# EasyEDA Pro project PCB.eprj, schematic Control_Logic
Board Name: Control_Logic; Create Date: 2025-08-13; Page Name: P1; Project Name: PCB; Schematic Name: Control_Logic; Update Date: 2025-08-13; Company: EasyEDA.com; Page Size: A4; Version: V1.0
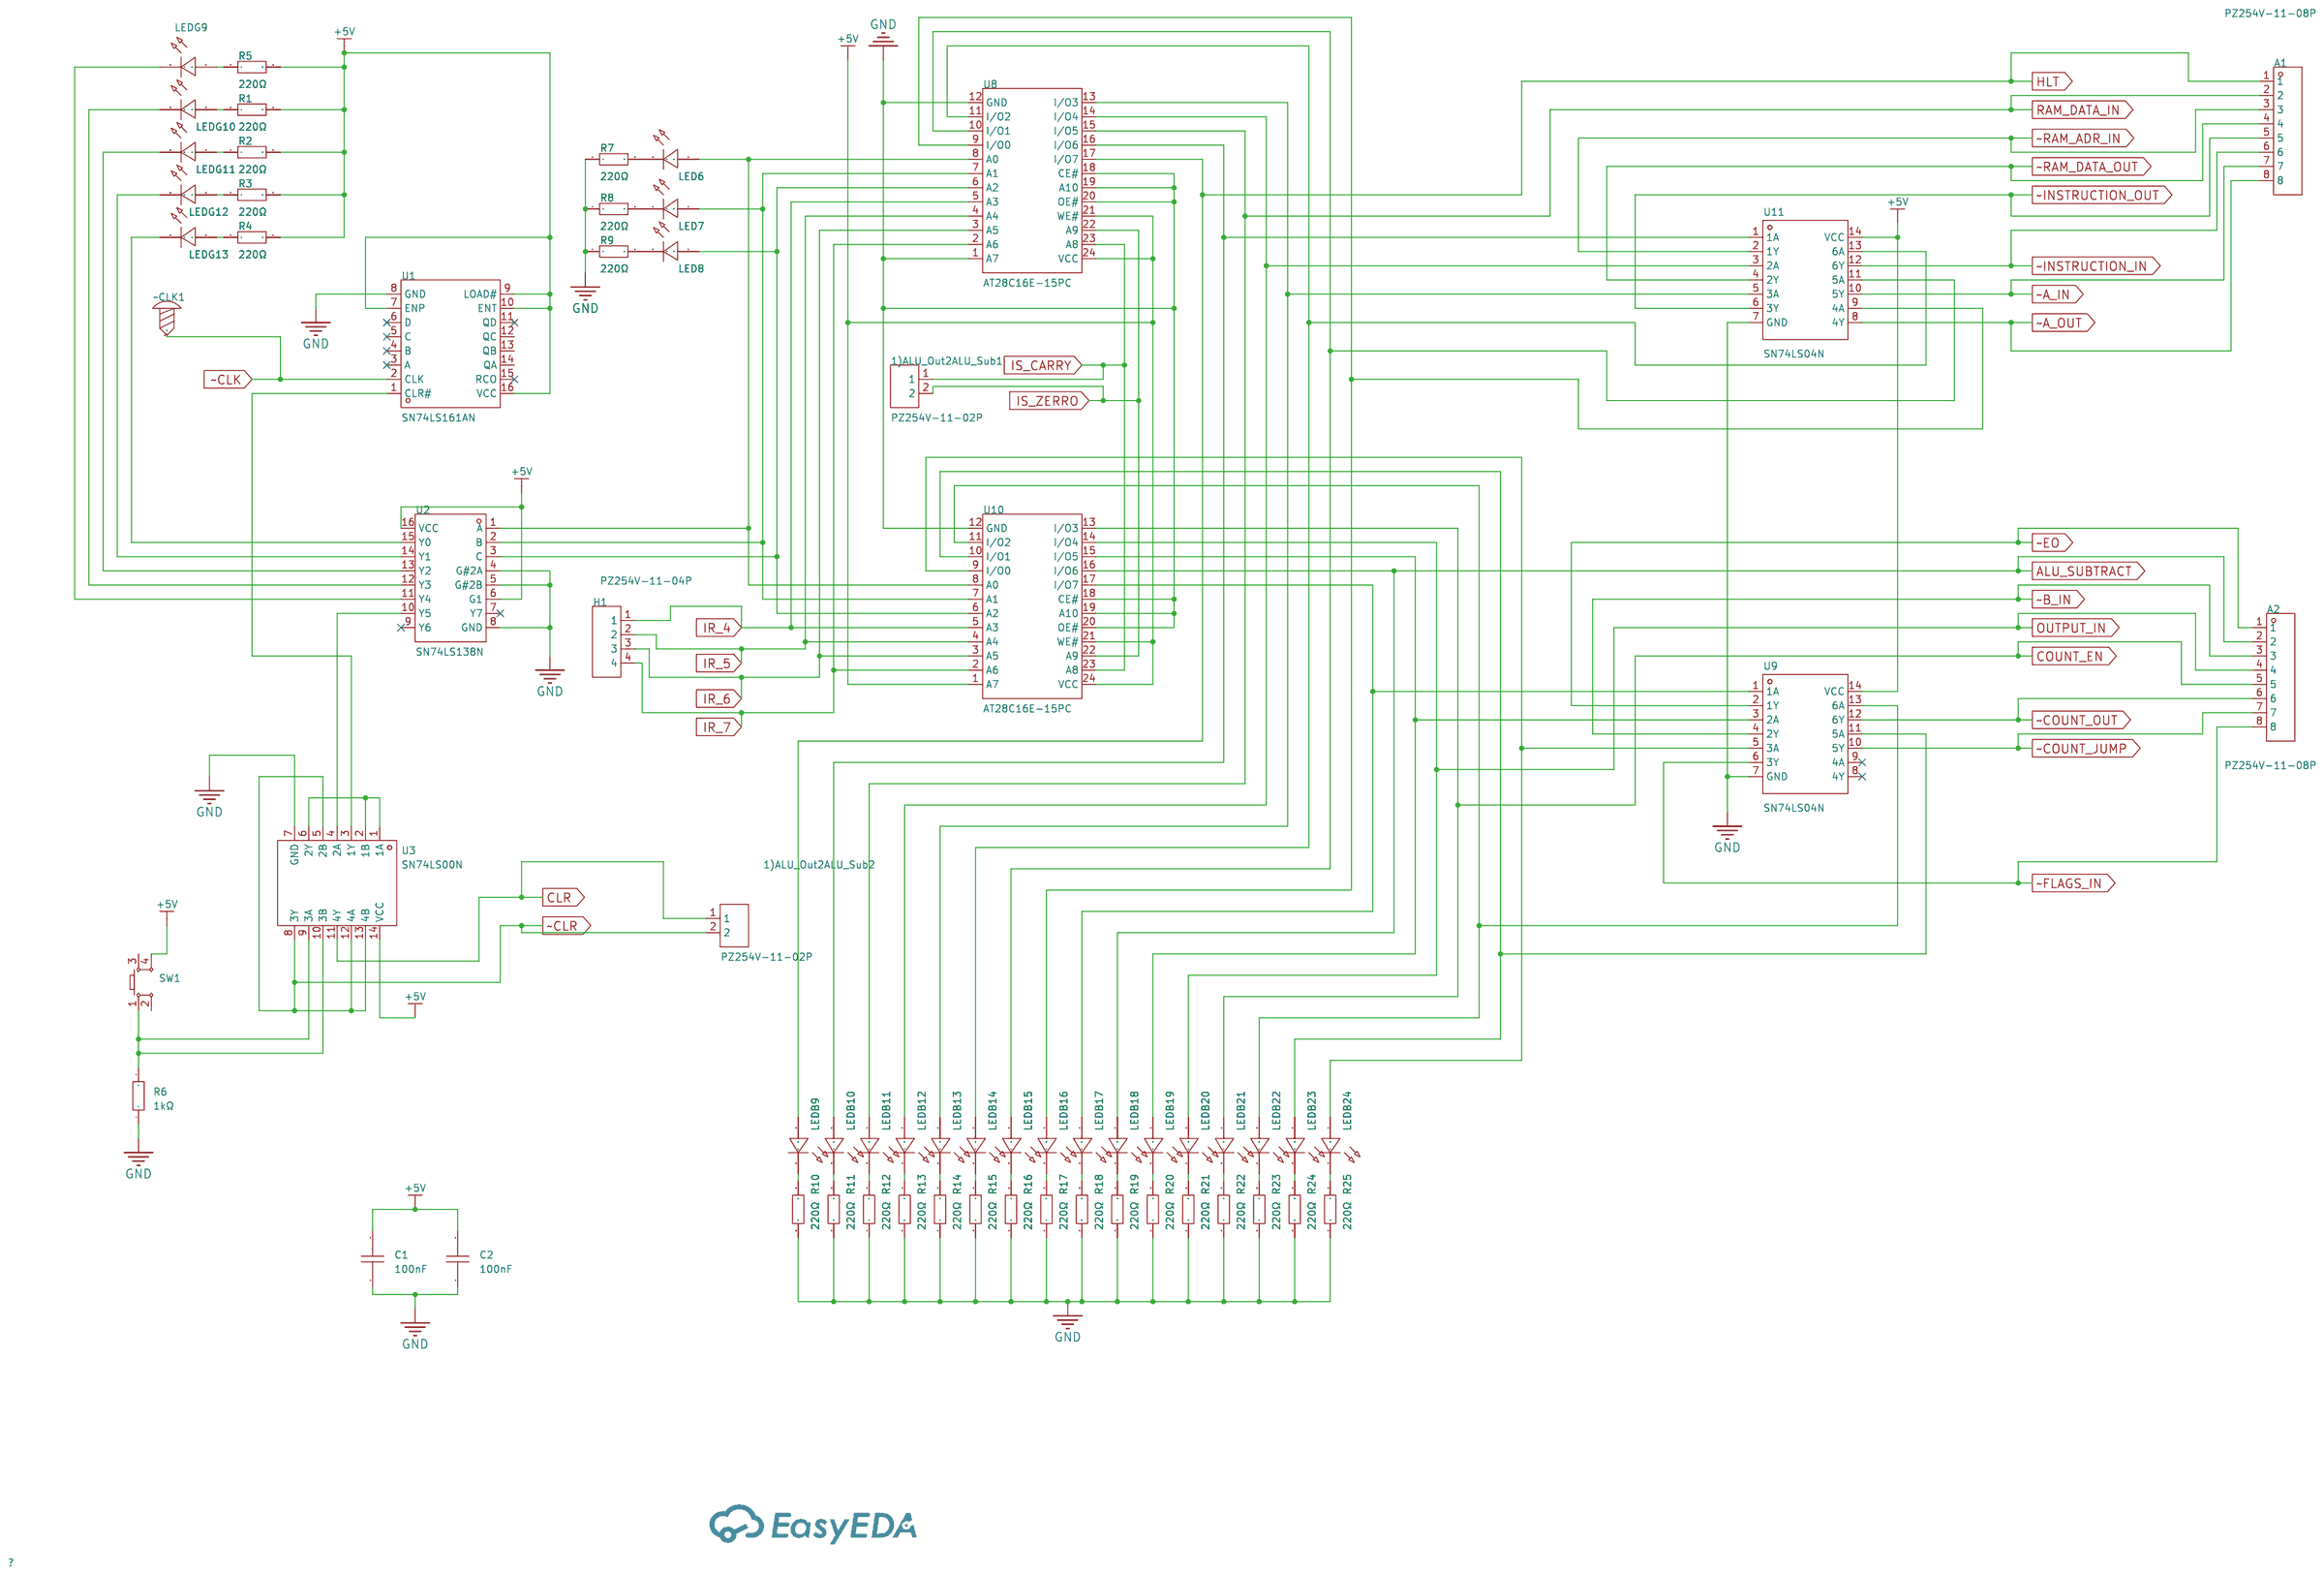
[diagram p7: schematic sheet]

## Parts
1)ALU_Out2ALU_Sub1  PZ254V-11-02P  [HDR-TH_2P-P2.54-V-M]
1)ALU_Out2ALU_Sub2  PZ254V-11-02P  [HDR-TH_2P-P2.54-V-M]
A1  PZ254V-11-08P  [HDR-TH_8P-P2.54-V-M]
A2  PZ254V-11-08P  [HDR-TH_8P-P2.54-V-M]
C1  100nF  [CAP-TH_L8.5-W5.0-P5.00-D1.2]
C2  100nF  [CAP-TH_L8.5-W5.0-P5.00-D1.2]
H1  PZ254V-11-04P  [HDR-TH_4P-P2.54-V-M]
LED6  -  [LED-TH_BD5.8-P2.54-FD]
LED7  -  [LED-TH_BD5.8-P2.54-FD]
LED8  -  [LED-TH_BD5.8-P2.54-FD]
LEDB9  -  [LED-TH_BD5.8-P2.54-FD]
LEDB10  -  [LED-TH_BD5.8-P2.54-FD]
LEDB11  -  [LED-TH_BD5.8-P2.54-FD]
LEDB12  -  [LED-TH_BD5.8-P2.54-FD]
LEDB13  -  [LED-TH_BD5.8-P2.54-FD]
LEDB14  -  [LED-TH_BD5.8-P2.54-FD]
LEDB15  -  [LED-TH_BD5.8-P2.54-FD]
LEDB16  -  [LED-TH_BD5.8-P2.54-FD]
LEDB17  -  [LED-TH_BD5.8-P2.54-FD]
LEDB18  -  [LED-TH_BD5.8-P2.54-FD]
LEDB19  -  [LED-TH_BD5.8-P2.54-FD]
LEDB20  -  [LED-TH_BD5.8-P2.54-FD]
LEDB21  -  [LED-TH_BD5.8-P2.54-FD]
LEDB22  -  [LED-TH_BD5.8-P2.54-FD]
LEDB23  -  [LED-TH_BD5.8-P2.54-FD]
LEDB24  -  [LED-TH_BD5.8-P2.54-FD]
LEDG9  -  [LED-TH_BD5.8-P2.54-FD]
LEDG10  -  [LED-TH_BD5.8-P2.54-FD]
LEDG11  -  [LED-TH_BD5.8-P2.54-FD]
LEDG12  -  [LED-TH_BD5.8-P2.54-FD]
LEDG13  -  [LED-TH_BD5.8-P2.54-FD]
R1  220Ω  [R_AXIAL-0.4]
R2  220Ω  [R_AXIAL-0.4]
R3  220Ω  [R_AXIAL-0.4]
R4  220Ω  [R_AXIAL-0.4]
R5  220Ω  [R_AXIAL-0.4]
R6  1kΩ  [R_AXIAL-0.4]
R7  220Ω  [R_AXIAL-0.4]
R8  220Ω  [R_AXIAL-0.4]
R9  220Ω  [R_AXIAL-0.4]
R10  220Ω  [R_AXIAL-0.4]
R11  220Ω  [R_AXIAL-0.4]
R12  220Ω  [R_AXIAL-0.4]
R13  220Ω  [R_AXIAL-0.4]
R14  220Ω  [R_AXIAL-0.4]
R15  220Ω  [R_AXIAL-0.4]
R16  220Ω  [R_AXIAL-0.4]
R17  220Ω  [R_AXIAL-0.4]
R18  220Ω  [R_AXIAL-0.4]
R19  220Ω  [R_AXIAL-0.4]
R20  220Ω  [R_AXIAL-0.4]
R21  220Ω  [R_AXIAL-0.4]
R22  220Ω  [R_AXIAL-0.4]
R23  220Ω  [R_AXIAL-0.4]
R24  220Ω  [R_AXIAL-0.4]
R25  220Ω  [R_AXIAL-0.4]
SW1  -  [KEY-TH_4P-L6.0-W6.0-P3.90-LS6.5]
U1  SN74LS161AN  [PDIP-16_L19.3-W6.4-P2.54-LS7.9-BL]
U2  SN74LS138N  [DIP-16_L19.8-W6.5-P2.54-LS7.6-BL]
U3  SN74LS00N  [PDIP-14_L19.7-W6.6-P2.54-LS8.3-BL]
U8  AT28C16E-15PC  [PDIP-24_L31.0-W13.5-P2.54-LS15.2-BL]
U9  SN74LS04N  [PDIP-14_L19.7-W6.6-P2.54-LS8.3-BL]
U10  AT28C16E-15PC  [PDIP-24_L31.0-W13.5-P2.54-LS15.2-BL]
U11  SN74LS04N  [PDIP-14_L19.7-W6.6-P2.54-LS8.3-BL]
~CLK1  -  [Screw-Hole-M2]

## Library data of the parts
1)ALU_Out2ALU_Sub1 1)ALU_Out2ALU_Sub2 = PZ254V-11-02P: LCSC Part Name: 1x2P 间距:2.54mm 方针 直插; Supplier Part: C492401; Manufacturer: XFCN(兴飞); Supplier Footprint: 插件,P=2.54mm; JLCPCB Part Class: Extended Part; Datasheet: https://atta.szlcsc.com/upload/public/pdf/source/20200309/C492401_A812433581A9B211A7FFA413ADDFF0E5.pdf; Supplier: LCSC; Pin Structure: 1x2P; Pitch: 2.54mm; Circluar Pins/Square Pins: Policy; Mounting Type: Straight; Number of Rows: Single Row; Number of Pins: 2P; Length of Mating Pin: 6mm; Insulation Height: 2.5mm; Length of End Connection Pin: 3mm; Contact Material: Brass; Operating Temperature: -40℃~+105℃; Color: Black
A1 A2 = PZ254V-11-08P: LCSC Part Name: 间距:2.54mm 1x8P 直插 方针; Supplier Part: C492407; Manufacturer: XFCN(兴飞); Supplier Footprint: 插件,P=2.54mm; JLCPCB Part Class: Extended Part; Datasheet: https://atta.szlcsc.com/upload/public/pdf/source/20200309/C492407_83A6FB26A2233368EDB9516968EC6149.pdf; Supplier: LCSC; Pin Structure: 1x8P; Pitch: 2.54mm; Circluar Pins/Square Pins: Square Pins; Mounting Type: Straight; Number of Rows: Plugin; Number of Pins: 8P; Length of Mating Pin: 6mm; Insulation Height: 2.5mm; Length of End Connection Pin: 3mm; Operating Temperature Range: -40℃~+105℃; Color: Black
C1 C2 = CT4-0805B104K500F3: LCSC Part Name: 100nF ±10% 50V C3型（直脚）; Supplier Part: C84772; Manufacturer: FH(风华); Supplier Footprint: 插件,P=5.08mm; JLCPCB Part Class: Extended Part; Datasheet: https://atta.szlcsc.com/upload/public/pdf/source/20190402/C385200_059806A6312B28FF1421A2413EB641E1.pdf; Supplier: LCSC; Tolerance: ±10%
H1 = PZ254V-11-04P_C492403: LCSC Part Name: 1x4P 间距:2.54mm 方针 直插; Supplier Part: C492403; Manufacturer: XFCN(兴飞); Supplier Footprint: 插件,P=2.54mm; JLCPCB Part Class: Extended Part; Datasheet: https://atta.szlcsc.com/upload/public/pdf/source/20200309/C492403_F9F19131791D08044AD4F84F8E751A34.pdf; Supplier: LCSC; Pin Structure: 1x4P; Pitch: 2.54mm; Circluar Pins/Square Pins: Policy; Mounting Type: Straight; Number of Rows: Single Row; Number of Pins: 4P; Length of Mating Pin: 6mm; Insulation Height: 2.5mm; Length of End Connection Pin: 3mm; Contact Material: Brass; Operating Temperature: -40℃~+105℃; Color: Black
LED6-LED8 LEDB9-LEDB24 LEDG9-LEDG13 = LED_TH-R_5mm: Supplier Footprint: Through
R1-R25 = Res_AXIAL-1/4W: Supplier Footprint: Through
SW1 = Key_TH_6x6x4.5: Supplier Footprint: Through
U1 = SN74LS161AN: LCSC Part Name: 25MHz 4位二进制计数器; Supplier Part: C1547960; Manufacturer: TI(德州仪器); Supplier Footprint: PDIP-16; JLCPCB Part Class: Extended Part; Datasheet: https://www.ti.com/cn/lit/gpn/sn74ls161a; Supplier: LCSC; Logic Type: Binary Counter; Direction: 向上计数器; Supply Voltage: 4.75V~5.25V; Number of Elements: 1; Number of Bits per Element: 4; Trigger Type: Positive Edge; Reset Style: 异步; Timing mode: Synchronous; Count Rate: 25MHz; Operating Temperature: 0℃~+70℃
U2 = SN74LS138N: Type:Decoder/Demultiplexers Voltage Supply Source:Single supply Supply Voltage:4.75V~5.25V Supply Voltage:4.75V~5.25V Sink Current:8mA Source Current:400uA Operating temperature:0℃~+70℃ Operating temperature:0℃~+70℃; Supplier Part: C352964; Manufacturer: TI(德州仪器); Supplier Footprint: DIP-16; JLCPCB Part Class: Extended Part; Datasheet: https://www.ti.com/cn/lit/gpn/sn74ls138; Supplier: LCSC; Type: Decoder/Demultiplexers; Voltage Supply Source: Single supply; Supply Voltage: 4.75V~5.25V; Sink Current: 8mA; Source Current: 400uA; Operating temperature: 0℃~+70℃
U3 = SN74LS00N: Logic Type:NAND Gate Number of Channels:4 Voltage - Supply:4.75V~5.25V Voltage - Supply:4.75V~5.25V Current - Output Low(IOL):8mA Current - Output High(IOH):400uA Input Logic Level - High:2V Input Logic Level - High:2V Input Logic Level - Low:800mV Input; Supplier Part: C181629; Manufacturer: TI(德州仪器); Supplier Footprint: PDIP-14; JLCPCB Part Class: Extended Part; Datasheet: https://www.ti.com/cn/lit/gpn/sn74ls00; Supplier: LCSC; Logic Type: NAND Gate; Number of Channels: 4; Voltage - Supply: 4.75V~5.25V; Current - Output Low(IOL): 8mA; Current - Output High(IOH): 400uA; Input Logic Level - High: 2V; Input Logic Level - Low: 800mV; Series: 74LSSeries; Propagation Delay: 15ns@5V,15pF; Operating Temperature: 0℃~+70℃
U8 U10 = AT28C16E-15PC: Supplier Part: C19393057; Manufacturer: MICROCHIP(美国微芯); Supplier Footprint: PDIP-24; JLCPCB Part Class: Extended Part; Datasheet: https://atta.szlcsc.com/upload/public/pdf/source/20231219/98B154FA288F53C07025EE50A49045E4.pdf; Supplier: LCSC
U9 U11 = SN74LS04N: Supplier Part: C183657; Manufacturer: TI(德州仪器); Supplier Footprint: PDIP-14; JLCPCB Part Class: Extended Part; Datasheet: https://www.ti.com/cn/lit/gpn/sn74ls04; Supplier: LCSC; Voltage - Supply: 4.75V~5.25V; Number of Circuits: 6; Number of Inputs: 1; Current - Output Low(IOL): 8mA; Current - Output High(IOH): 400uA; Input Logic Level - High: 2V; Input Logic Level -Low: 800mV; Max Propagation Delay: 15ns@5V,15pF; Series: 74LSSeries; Operating Temperature: 0℃~+70℃
~CLK1 = Screw-Hole-M2: Supplier Footprint: 插件

## Nets
+5V: C1.2 C2.2 R1.2 R2.2 R3.2 R4.2 R5.2 SW1.4 U1.7(ENP) U1.9(LOAD#) U1.10(ENT) U1.16(VCC) U2.6(G1) U2.16(VCC) U3.14(VCC) U8.21(WE#) U8.24(VCC) U9.14(VCC) U10.1(A7) U10.21(WE#) U10.24(VCC) U11.14(VCC)
GND: C1.1 C2.1 R6.1 R7.1 R8.1 R9.1 R10.1 R11.1 R12.1 R13.1 R14.1 R15.1 R16.1 R17.1 R18.1 R19.1 R20.1 R21.1 R22.1 R23.1 R24.1 R25.1 U1.8(GND) U2.4(G#2A) U2.5(G#2B) U2.8(GND) U3.7(GND) U8.1(A7) U8.12(GND) U8.18(CE#) U8.19(A10) U8.20(OE#) U9.7(GND) U10.12(GND) U10.18(CE#) U10.19(A10) U10.20(OE#) U11.7(GND)
ALU_SUBTRACT: A2.2 LEDB18.1(C) U10.16(I/O6)
CLR: 1)ALU_Out2ALU_Sub2.1 U3.11(4Y)
COUNT_EN: A2.5 LEDB21.1(C) U10.13(I/O3)
HLT: A1.1 LEDB9.1(C) U8.17(I/O7)
IR_4: H1.1 U8.5(A3) U10.5(A3)
IR_5: H1.2 U8.4(A4) U10.4(A4)
IR_6: H1.3 U8.3(A5) U10.3(A5)
IR_7: H1.4 U8.2(A6) U10.2(A6)
IS_CARRY: 1)ALU_Out2ALU_Sub1.1 U8.23(A8) U10.23(A8)
IS_ZERRO: 1)ALU_Out2ALU_Sub1.2 U8.22(A9) U10.22(A9)
OUTPUT_IN: A2.4 LEDB20.1(C) U10.14(I/O4)
RAM_DATA_IN: A1.2 LEDB11.1(C) U8.15(I/O5)
~A_IN: A1.7 U11.10(5Y)
~A_OUT: A1.8 U11.8(4Y)
~B_IN: A2.3 U9.4(2Y)
~CLK: U1.2(CLK) ~CLK1.1
~CLR: 1)ALU_Out2ALU_Sub2.2 U3.5(2B) U3.8(3Y) U3.12(4A) U3.13(4B)
~COUNT_JUMP: A2.7 U9.10(5Y)
~COUNT_OUT: A2.6 U9.12(6Y)
~EO: A2.1 U9.2(1Y)
~FLAGS_IN: A2.8 U9.6(3Y)
~INSTRUCTION_IN: A1.6 U11.12(6Y)
~INSTRUCTION_OUT: A1.5 U11.6(3Y)
~RAM_ADR_IN: A1.3 U11.2(1Y)
~RAM_DATA_OUT: A1.4 U11.4(2Y)
Net-(LED6-1): LED6.1(C) U2.1(A) U8.8(A0) U10.8(A0)
Net-(LED6-2): LED6.2(A) R7.2
Net-(LED7-1): LED7.1(C) U2.2(B) U8.7(A1) U10.7(A1)
Net-(LED7-2): LED7.2(A) R8.2
Net-(LED8-1): LED8.1(C) U2.3(C) U8.6(A2) U10.6(A2)
Net-(LED8-2): LED8.2(A) R9.2
Net-(LEDB9-2): LEDB9.2(A) R10.2
Net-(LEDB10-1): LEDB10.1(C) U8.16(I/O6) U11.1(1A)
Net-(LEDB10-2): LEDB10.2(A) R11.2
Net-(LEDB11-2): LEDB11.2(A) R12.2
Net-(LEDB12-1): LEDB12.1(C) U8.14(I/O4) U11.3(2A)
Net-(LEDB12-2): LEDB12.2(A) R13.2
Net-(LEDB13-1): LEDB13.1(C) U8.13(I/O3) U11.5(3A)
Net-(LEDB13-2): LEDB13.2(A) R14.2
Net-(LEDB14-1): LEDB14.1(C) U8.11(I/O2) U11.13(6A)
Net-(LEDB14-2): LEDB14.2(A) R15.2
Net-(LEDB15-1): LEDB15.1(C) U8.10(I/O1) U11.11(5A)
Net-(LEDB15-2): LEDB15.2(A) R16.2
Net-(LEDB16-1): LEDB16.1(C) U8.9(I/O0) U11.9(4A)
Net-(LEDB16-2): LEDB16.2(A) R17.2
Net-(LEDB17-1): LEDB17.1(C) U9.1(1A) U10.17(I/O7)
Net-(LEDB17-2): LEDB17.2(A) R18.2
Net-(LEDB18-2): LEDB18.2(A) R19.2
Net-(LEDB19-1): LEDB19.1(C) U9.3(2A) U10.15(I/O5)
Net-(LEDB19-2): LEDB19.2(A) R20.2
Net-(LEDB20-2): LEDB20.2(A) R21.2
Net-(LEDB21-2): LEDB21.2(A) R22.2
Net-(LEDB22-1): LEDB22.1(C) U9.13(6A) U10.11(I/O2)
Net-(LEDB22-2): LEDB22.2(A) R23.2
Net-(LEDB23-1): LEDB23.1(C) U9.11(5A) U10.10(I/O1)
Net-(LEDB23-2): LEDB23.2(A) R24.2
Net-(LEDB24-1): LEDB24.1(C) U9.5(3A) U10.9(I/O0)
Net-(LEDB24-2): LEDB24.2(A) R25.2
Net-(LEDG9-1): LEDG9.1(C) R5.1
Net-(LEDG9-2): LEDG9.2(A) U2.11(Y4)
Net-(LEDG10-1): LEDG10.1(C) R1.1
Net-(LEDG10-2): LEDG10.2(A) U2.12(Y3)
Net-(LEDG11-1): LEDG11.1(C) R2.1
Net-(LEDG11-2): LEDG11.2(A) U2.13(Y2)
Net-(LEDG12-1): LEDG12.1(C) R3.1
Net-(LEDG12-2): LEDG12.2(A) U2.14(Y1)
Net-(LEDG13-1): LEDG13.1(C) R4.1
Net-(LEDG13-2): LEDG13.2(A) U2.15(Y0)
Net-(R6-2): R6.2 SW1.1 U3.9(3A) U3.10(3B)
Net-(U1-1): U1.1(CLR#) U3.3(1Y)
Net-(U2-10): U2.10(Y5) U3.4(2A)
Net-(U3-1): U3.1(1A) U3.2(1B) U3.6(2Y)

Not connected (* = marked no-connect by the designer): SW1 2 3; U1 3(A)* 4(B)* 5(C)* 6(D)* 11(QD)* 12(QC) 13(QB) 14(QA) 15(RCO)*; U2 7(Y7)* 9(Y6)*; U9 8(4Y)* 9(4A)*
